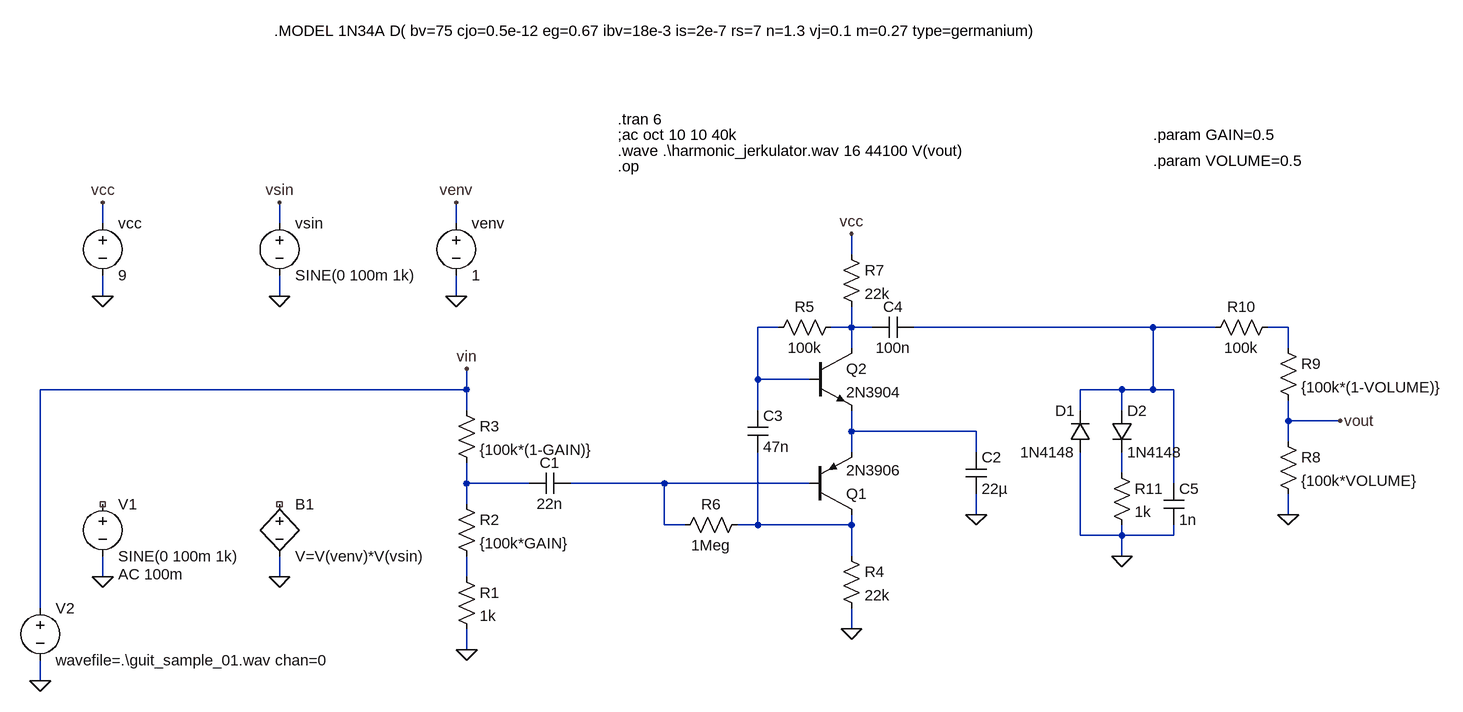
[diagram p0: schematic harmonic_jerkulator_01.asc]
harmonic_jerkulator_01.asc, the LTspice schematic file:
Version 4
SHEET 1 3096 680
WIRE -512 -320 -512 -352
WIRE -240 -320 -240 -352
WIRE 32 -320 32 -352
WIRE 640 -272 640 -304
WIRE -512 -208 -512 -240
WIRE -240 -208 -240 -240
WIRE 32 -208 32 -240
WIRE 528 -160 496 -160
WIRE 640 -160 640 -192
WIRE 640 -160 608 -160
WIRE 672 -160 640 -160
WIRE 1104 -160 736 -160
WIRE 1200 -160 1104 -160
WIRE 1312 -160 1280 -160
WIRE 640 -128 640 -160
WIRE 1312 -128 1312 -160
WIRE 496 -80 496 -160
WIRE 576 -80 496 -80
WIRE 48 -64 48 -96
WIRE 48 -64 -608 -64
WIRE 1056 -64 992 -64
WIRE 1104 -64 1104 -160
WIRE 1104 -64 1056 -64
WIRE 1136 -64 1104 -64
WIRE 48 -32 48 -64
WIRE 496 -32 496 -80
WIRE 992 -32 992 -64
WIRE 1056 -32 1056 -64
WIRE 1312 -16 1312 -48
WIRE 1392 -16 1312 -16
WIRE 640 0 640 -32
WIRE 832 0 640 0
WIRE 1312 16 1312 -16
WIRE 640 32 640 0
WIRE 832 32 832 0
WIRE 1056 64 1056 32
WIRE 48 80 48 48
WIRE 144 80 48 80
WIRE 352 80 208 80
WIRE 576 80 352 80
WIRE 1136 80 1136 -64
WIRE 48 112 48 80
WIRE 832 128 832 96
WIRE 1312 128 1312 96
WIRE 352 144 352 80
WIRE 384 144 352 144
WIRE 496 144 496 32
WIRE 496 144 464 144
WIRE 640 144 640 128
WIRE 640 144 496 144
WIRE 992 160 992 32
WIRE 1056 160 1056 144
WIRE 1056 160 992 160
WIRE 1136 160 1136 144
WIRE 1136 160 1056 160
WIRE 640 192 640 144
WIRE 1056 192 1056 160
WIRE -512 224 -512 192
WIRE -240 224 -240 192
WIRE 48 224 48 192
WIRE -608 272 -608 -64
WIRE 640 304 640 272
WIRE 48 336 48 304
WIRE -608 384 -608 352
FLAG 48 336 0
FLAG 832 128 0
FLAG 640 304 0
FLAG 1312 128 0
FLAG 640 -304 vcc
FLAG -512 -352 vcc
FLAG -512 -208 0
FLAG -240 -208 0
FLAG 32 -208 0
FLAG -240 -352 vsin
FLAG 32 -352 venv
FLAG -240 224 0
FLAG -512 224 0
FLAG 1392 -16 vout
FLAG 48 -96 vin
FLAG -608 384 0
FLAG 1056 192 0
SYMBOL res 32 208 R0
SYMATTR InstName R1
SYMATTR Value 1k
SYMBOL res 32 96 R0
SYMATTR InstName R2
SYMATTR Value {100k*GAIN}
SYMBOL res 32 -48 R0
SYMATTR InstName R3
SYMATTR Value {100k*(1-GAIN)}
SYMBOL voltage -512 -336 R0
SYMATTR InstName vcc
SYMATTR Value 9
SYMBOL voltage -240 -336 R0
WINDOW 123 0 0 Left 2
WINDOW 39 0 0 Left 2
SYMATTR InstName vsin
SYMATTR Value SINE(0 100m 1k)
SYMBOL voltage 32 -336 R0
WINDOW 123 0 0 Left 2
WINDOW 39 0 0 Left 2
SYMATTR InstName venv
SYMATTR Value 1
SYMBOL cap 208 64 R90
WINDOW 0 0 32 VBottom 2
WINDOW 3 32 32 VTop 2
SYMATTR InstName C1
SYMATTR Value 22n
SYMBOL pnp 576 128 M180
SYMATTR InstName Q1
SYMATTR Value 2N3906
SYMBOL npn 576 -128 R0
SYMATTR InstName Q2
SYMATTR Value 2N3904
SYMBOL cap 816 32 R0
SYMATTR InstName C2
SYMATTR Value 22µ
SYMBOL res 624 176 R0
SYMATTR InstName R4
SYMATTR Value 22k
SYMBOL cap 480 -32 R0
SYMATTR InstName C3
SYMATTR Value 47n
SYMBOL res 624 -176 R90
WINDOW 0 0 56 VBottom 2
WINDOW 3 32 56 VTop 2
SYMATTR InstName R5
SYMATTR Value 100k
SYMBOL res 480 128 R90
WINDOW 0 0 56 VBottom 2
WINDOW 3 32 56 VTop 2
SYMATTR InstName R6
SYMATTR Value 1Meg
SYMBOL res 624 -288 R0
SYMATTR InstName R7
SYMATTR Value 22k
SYMBOL cap 736 -176 R90
WINDOW 0 0 32 VBottom 2
WINDOW 3 32 32 VTop 2
SYMATTR InstName C4
SYMATTR Value 100n
SYMBOL res 1296 0 R0
SYMATTR InstName R8
SYMATTR Value {100k*VOLUME}
SYMBOL res 1296 -144 R0
SYMATTR InstName R9
SYMATTR Value {100k*(1-VOLUME)}
SYMBOL bv -240 96 R0
SYMATTR InstName B1
SYMATTR Value V=V(venv)*V(vsin)
SYMBOL voltage -512 96 R0
WINDOW 123 24 124 Left 2
WINDOW 39 0 0 Left 2
SYMATTR Value2 AC 100m
SYMATTR InstName V1
SYMATTR Value SINE(0 100m 1k)
SYMBOL res 1296 -176 R90
WINDOW 0 0 56 VBottom 2
WINDOW 3 32 56 VTop 2
SYMATTR InstName R10
SYMATTR Value 100k
SYMBOL voltage -608 256 R0
SYMATTR InstName V2
SYMATTR Value wavefile=.\guit_sample_01.wav chan=0
SYMBOL diode 1008 32 R180
WINDOW 0 24 64 Left 2
WINDOW 3 24 0 Left 2
SYMATTR InstName D1
SYMATTR Value 1N4148
SYMBOL diode 1040 -32 R0
SYMATTR InstName D2
SYMATTR Value 1N4148
SYMBOL res 1040 48 R0
SYMATTR InstName R11
SYMATTR Value 1k
SYMBOL cap 1120 80 R0
SYMATTR InstName C5
SYMATTR Value 1n
TEXT 1104 -456 Left 2 !.param GAIN=0.5
TEXT 1104 -416 Left 2 !.param VOLUME=0.5
TEXT 280 -480 Left 2 !.tran 6
TEXT 280 -456 Left 2 !;ac oct 10 10 40k
TEXT 280 -432 Left 2 !.wave .\\harmonic_jerkulator.wav 16 44100 V(vout)
TEXT -248 -616 Left 2 !.MODEL 1N34A D( bv=75 cjo=0.5e-12 eg=0.67 ibv=18e-3 is=2e-7 rs=7 n=1.3 vj=0.1 m=0.27 type=germanium)
TEXT 280 -408 Left 2 !.op

The netlist it stands for:
* harmonic_jerkulator_01.asc
R1 N010 0 1k
R2 N007 N010 {100k*GAIN}
R3 vin N007 {100k*(1-GAIN)}
vcc vcc 0 9
vsin vsin 0 SINE(0 100m 1k)
venv venv 0 1
C1 N008 N007 22n
Q1 N009 N008 N005 0 2N3906
Q2 N002 N001 N005 0 2N3904
C2 N005 0 22µ
R4 N009 0 22k
C3 N001 N009 47n
R5 N002 N001 100k
R6 N009 N008 1Meg
R7 vcc N002 22k
C4 N003 N002 100n
R8 vout 0 {100k*VOLUME}
R9 N004 vout {100k*(1-VOLUME)}
B1 NC_01 0 V=V(venv)*V(vsin)
V1 NC_02 0 SINE(0 100m 1k) AC 100m
R10 N004 N003 100k
V2 vin 0 wavefile=.\guit_sample_01.wav chan=0
D1 0 N003 1N4148
D2 N003 N006 1N4148
R11 N006 0 1k
C5 N003 0 1n
.model D D
.lib standard.dio
.model NPN NPN
.model PNP PNP
.lib standard.bjt
.param GAIN=0.5
.param VOLUME=0.5
.tran 6
;ac oct 10 10 40k
.wave .\harmonic_jerkulator.wav 16 44100 V(vout)
.MODEL 1N34A D( bv=75 cjo=0.5e-12 eg=0.67 ibv=18e-3 is=2e-7 rs=7 n=1.3 vj=0.1 m=0.27 type=germanium)
.op
.backanno
.end